# Altium schematic sheet react4.SchDoc
size A4
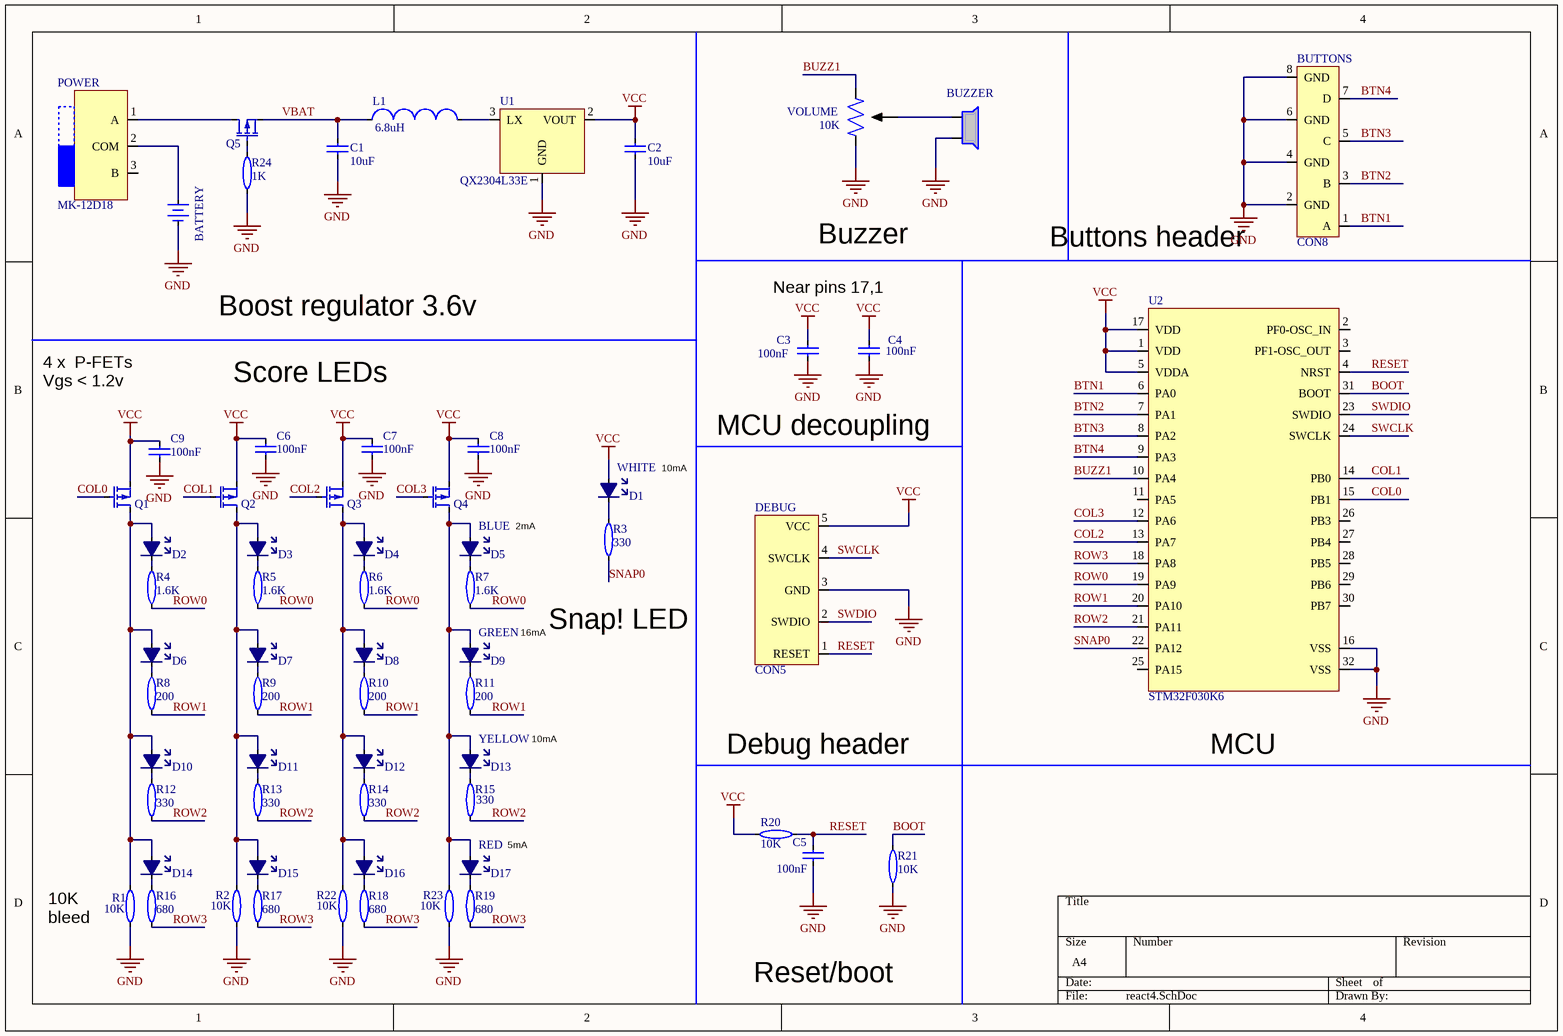
[diagram p0: react4.SchDoc]

## Parts
BATTERY  BATTERY  [BATTERY_CONNECTOR]  (value not drawn)  (no BOM)
BUTTONS  CON8  [CON8]
BUZZER  BUZZER  [PIEZO_BUZZER]  (value not drawn)
C1  value 10uF  [CAPC_1206_3216X16L]  (hidden comment: CAPACITOR)
C2  value 10uF  [CAPC_1206_3216X16L]  (hidden comment: CAPACITOR)
C3  value 100nF  [CAPC_0603_1608X08L]  (hidden comment: CAPACITOR)
C4  value 100nF  [CAPC_0603_1608X08L]  (hidden comment: CAPACITOR)
C5  value 100nF  [CAPC_0603_1608X08L]  (hidden comment: CAPACITOR)
C6  value 100nF  [CAPC_0603_1608X08L]  (hidden comment: CAPACITOR)
C7  value 100nF  [CAPC_0603_1608X08L]  (hidden comment: CAPACITOR)
C8  value 100nF  [CAPC_0603_1608X08L]  (hidden comment: CAPACITOR)
C9  value 100nF  [CAPC_0603_1608X08L]  (hidden comment: CAPACITOR)
D1  WHITE  [LED WHITE]
D2  BLUE  [LED BLUE]  (value not drawn)
D3  BLUE  [LED BLUE]  (value not drawn)
D4  BLUE  [LED BLUE]  (value not drawn)
D5  BLUE  [LED BLUE]
D6  GREEN  [LED GREEN]  (value not drawn)
D7  GREEN  [LED GREEN]  (value not drawn)
D8  GREEN  [LED GREEN]  (value not drawn)
D9  GREEN  [LED GREEN]
D10  YELLOW  [LED YELLOW]  (value not drawn)
D11  YELLOW  [LED YELLOW]  (value not drawn)
D12  YELLOW  [LED YELLOW]  (value not drawn)
D13  YELLOW  [LED YELLOW]
D14  RED  [LED RED]  (value not drawn)
D15  RED  [LED RED]  (value not drawn)
D16  RED  [LED RED]  (value not drawn)
D17  RED  [LED RED]
DEBUG  CON5  [CON5]  (no BOM)
L1  value 6.8uH  [Chip2PinSM127P600-8N]  (hidden comment: INDUCTOR)
POWER  MK-12D18  [MK-12D18]
Q1  NX2301P  [SOT95P237X110-3L]  (value not drawn)
Q2  NX2301P  [SOT95P237X110-3L]  (value not drawn)
Q3  NX2301P  [SOT95P237X110-3L]  (value not drawn)
Q4  NX2301P  [SOT95P237X110-3L]  (value not drawn)
Q5  NX2301P  [SOT95P237X110-3L]  (value not drawn)
R1  value 10K  [RESC_0603_1608X08L]  (hidden comment: RESISTOR)
R2  value 10K  [RESC_0603_1608X08L]  (hidden comment: RESISTOR)
R3  value 330  [RESC_0603_1608X08L]  (hidden comment: RESISTOR)
R4  value 1.6K  [RESC_0603_1608X08L]  (hidden comment: RESISTOR)
R5  value 1.6K  [RESC_0603_1608X08L]  (hidden comment: RESISTOR)
R6  value 1.6K  [RESC_0603_1608X08L]  (hidden comment: RESISTOR)
R7  value 1.6K  [RESC_0603_1608X08L]  (hidden comment: RESISTOR)
R8  value 200  [RESC_0603_1608X08L]  (hidden comment: RESISTOR)
R9  value 200  [RESC_0603_1608X08L]  (hidden comment: RESISTOR)
R10  value 200  [RESC_0603_1608X08L]  (hidden comment: RESISTOR)
R11  value 200  [RESC_0603_1608X08L]  (hidden comment: RESISTOR)
R12  value 330  [RESC_0603_1608X08L]  (hidden comment: RESISTOR)
R13  value 330  [RESC_0603_1608X08L]  (hidden comment: RESISTOR)
R14  value 330  [RESC_0603_1608X08L]  (hidden comment: RESISTOR)
R15  value 330  [RESC_0603_1608X08L]  (hidden comment: RESISTOR)
R16  value 680  [RESC_0603_1608X08L]  (hidden comment: RESISTOR)
R17  value 680  [RESC_0603_1608X08L]  (hidden comment: RESISTOR)
R18  value 680  [RESC_0603_1608X08L]  (hidden comment: RESISTOR)
R19  value 680  [RESC_0603_1608X08L]  (hidden comment: RESISTOR)
R20  value 10K  [RESC_0603_1608X08L]  (hidden comment: RESISTOR)
R21  value 10K  [RESC_0603_1608X08L]  (hidden comment: RESISTOR)
R22  value 10K  [RESC_0603_1608X08L]  (hidden comment: RESISTOR)
R23  value 10K  [RESC_0603_1608X08L]  (hidden comment: RESISTOR)
R24  value 1K  [RESC_0603_1608X08L]  (hidden comment: RESISTOR)
U1  QX2304L33E  [SOT89-150P350X160-3L]
U2  STM32F030K6  [TQFP80P900X900X160-32L]
VOLUME  value 10K  [POTENTIOMETER]  (hidden comment: POTENTIOMETER)

## Nets
GND: BATTERY.1(NEGATIVE) BUTTONS.2(GND) BUTTONS.4(GND) BUTTONS.6(GND) BUTTONS.8(GND) BUZZER.2 C1.1 C2.1 C3.1 C4.1 C5.1 C6.1 C7.1 C8.1 C9.1 DEBUG.3(GND) R1.2 R2.2 R21.2 R22.2 R23.2 R24.1 U1.1(GND) U2.16(VSS) U2.32(VSS) VOLUME.3
VCC: C2.2 C3.2 C4.2 C6.2 C7.2 C8.2 C9.2 D1.2(A) DEBUG.5(VCC) Q1.2(S) Q2.2(S) Q3.2(S) Q4.2(S) R20.2 U1.2(VOUT) U2.1(VDD) U2.5(VDDA) U2.17(VDD)
BOOT: R21.1 U2.31(BOOT)
BTN1: BUTTONS.1(A) U2.6(PA0)
BTN2: BUTTONS.3(B) U2.7(PA1)
BTN3: BUTTONS.5(C) U2.8(PA2)
BTN4: BUTTONS.7(D) U2.9(PA3)
BUZZ1: U2.10(PA4) VOLUME.1
COL0: Q1.1(G) U2.15(PB1)
COL1: Q2.1(G) U2.14(PB0)
COL2: Q3.1(G) U2.13(PA7)
COL3: Q4.1(G) U2.12(PA6)
RESET: C5.2 DEBUG.1(RESET) R20.1 U2.4(NRST)
ROW0: R4.1 R5.1 R6.1 R7.1 U2.19(PA9)
ROW1: R8.1 R9.1 R10.1 R11.1 U2.20(PA10)
ROW2: R12.1 R13.1 R14.1 R15.1 U2.21(PA11)
ROW3: R16.1 R17.1 R18.1 R19.1 U2.18(PA8)
SNAP0: R3.1 U2.22(PA12)
SWCLK: DEBUG.4(SWCLK) U2.24(SWCLK)
SWDIO: DEBUG.2(SWDIO) U2.23(SWDIO)
VBAT: C1.2 L1.1 Q5.2(S)
NetBATTERY_2: BATTERY.2(POSITIVE) POWER.2(COM)
NetBUZZER_1: BUZZER.1 VOLUME.2
NetD1_1: D1.1(C) R3.2
NetD2_1: D2.1(C) R4.2
NetD2_2: D2.2(A) D6.2(A) D10.2(A) D14.2(A) Q1.3(D) R1.1
NetD3_1: D3.1(C) R5.2
NetD3_2: D3.2(A) D7.2(A) D11.2(A) D15.2(A) Q2.3(D) R2.1
NetD4_1: D4.1(C) R6.2
NetD4_2: D4.2(A) D8.2(A) D12.2(A) D16.2(A) Q3.3(D) R22.1
NetD5_1: D5.1(C) R7.2
NetD5_2: D5.2(A) D9.2(A) D13.2(A) D17.2(A) Q4.3(D) R23.1
NetD6_1: D6.1(C) R8.2
NetD7_1: D7.1(C) R9.2
NetD8_1: D8.1(C) R10.2
NetD9_1: D9.1(C) R11.2
NetD10_1: D10.1(C) R12.2
NetD11_1: D11.1(C) R13.2
NetD12_1: D12.1(C) R14.2
NetD13_1: D13.1(C) R15.2
NetD14_1: D14.1(C) R16.2
NetD15_1: D15.1(C) R17.2
NetD16_1: D16.1(C) R18.2
NetD17_1: D17.1(C) R19.2
NetL1_2: L1.2 U1.3(LX)
NetPOWER_1: POWER.1(A) Q5.3(D)
NetQ5_1: Q5.1(G) R24.2

Not connected (* = marked no-connect by the designer): POWER 3(B); U2 2(PF0-OSC_IN) 3(PF1-OSC_OUT) 11(PA5) 25(PA15) 26(PB3) 27(PB4) 28(PB5) 29(PB6) 30(PB7)

## Notes on the sheet
- Buzzer
- (near BUTTONS) Buttons header
- Boost regulator 3.6v
- Near pins 17,1
- Score LEDs
- (near C9) 4 x  P-FETs
  Vgs < 1.2v ideally
  200mW at least
- MCU decoupling
- 10mA
- 2mA
- 16mA
- (near R3) Snap! LED
- Debug header
- MCU
- 5mA
- (near R1) 10K bleed
  resistors
- Reset/boot

## Library data of the parts
BUTTONS = CON8: 2 x 4 2.54mm IDC board connector
BUZZER = BUZZER: 3V 12mm piezo buzzer
D1 D10-D13 = LED: 5mm through hole LED; Value: 10mA
D2-D5 = LED: 5mm through hole LED; Value: 2mA
D6-D9 = LED: 5mm through hole LED; Value: 16mA
D14-D17 = LED: 5mm through hole LED; Value: 5mA
L1 = INDUCTOR: 200mA 1206 SMD Inductor
POWER = SPDT SWITCH: DIP,9.1x3.5x3.5mm Toggle Switch; Value: MK-12D18
Q1-Q5 = MOSFET-P: P-MOSFET -20V -2A 400mW NX2301P or equivalent; Value: NX2301P
R1-R24 = RESISTOR: 125mW 0603 SMD resistor
U1 = QX2304L33E: 3.3v boost regulator 1A 0.5W; Value: QX2304L33E
U2 = STM32F030K6: STM32F030K6 QFP32 48MHz; Value: STM32F030K6
VOLUME = POTENTIOMETER: 10K audio pot 16x2mm thumbwheel